# Altium schematic sheet RcMPPT-BMS.SchDoc: RcMPPT-BMS
size A4; Author: Thomas Hofmann; CompanyName: HTL St. Pölten; Organization: Altium Limited; Address1: RcMPPT; Address2: Frenchs Forest; Address3: NSW; Address4: Australia 2086; DocumentNumber: 2; Revision: 2.0; SheetNumber: 2; SheetTotal: 3
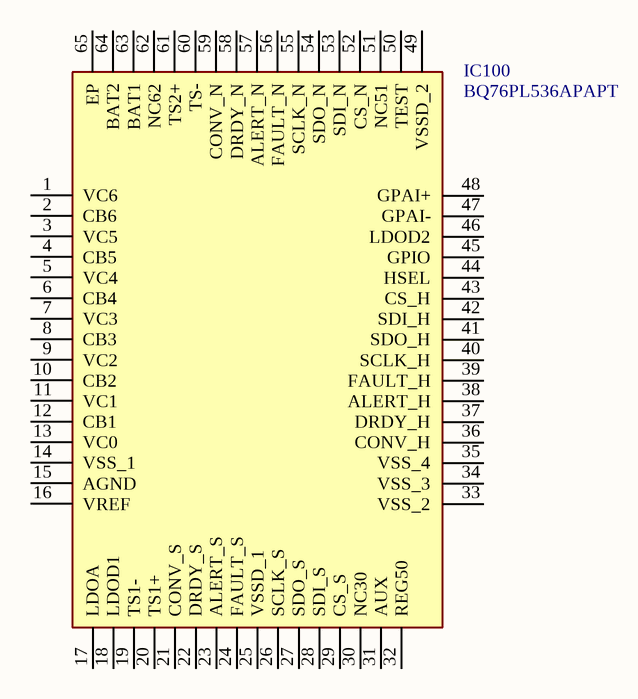
[diagram p0: RcMPPT-BMS.SchDoc]

## Parts
IC100  BQ76PL536APAPT  [QFP50P1200X1200X120-65N]

## Nets

Not connected (* = marked no-connect by the designer): IC100 1(VC6) 2(CB6) 3(VC5) 4(CB5) 5(VC4) 6(CB4) 7(VC3) 8(CB3) 9(VC2) 10(CB2) 11(VC1) 12(CB1) 13(VC0) 14(VSS_1) 15(AGND) 16(VREF) 17(LDOA) 18(LDOD1) 19(TS1-) 20(TS1+) 21(CONV_S) 22(DRDY_S) 23(ALERT_S) 24(FAULT_S) 25(VSSD_1) 26(SCLK_S) 27(SDO_S) 28(SDI_S) 29(CS_S) 30(NC30) 31(AUX) 32(REG50) 33(VSS_2) 34(VSS_3) 35(VSS_4) 36(CONV_H) 37(DRDY_H) 38(ALERT_H) 39(FAULT_H) 40(SCLK_H) 41(SDO_H) 42(SDI_H) 43(CS_H) 44(HSEL) 45(GPIO) 46(LDOD2) 47(GPAI-) 48(GPAI+) 49(VSSD_2) 50(TEST) 51(NC51) 52(CS_N) 53(SDI_N) 54(SDO_N) 55(SCLK_N) 56(FAULT_N) 57(ALERT_N) 58(DRDY_N) 59(CONV_N) 60(TS-) 61(TS2+) 62(NC62) 63(BAT1) 64(BAT2) 65(EP)

## Notes on the sheet
- Title
- Size:
- Date:
- A4
- Number:
- Time:
- Revision:
- Sheet
- of
- File:

## Library data of the parts
IC100 = BQ76PL536APAPT: Integrated Circuit; Manufacturer_Name: Texas Instruments; Datasheet Link: http://www.ti.com/lit/gpn/bq76pl536a; Height: 1.2mm; Manufacturer_Part_Number: BQ76PL536APAPT; Mouser Part Number: 595-BQ76PL536APAPT; Mouser Price/Stock: https://www.mouser.co.uk/ProductDetail/Texas-Instruments/BQ76PL536APAPT?qs=UlfnwZ2x8nT1EXA%252BD%252BEfIQ%3D%3D; Arrow Part Number: BQ76PL536APAPT; Arrow Price/Stock: https://www.arrow.com/en/products/bq76pl536apapt/texas-instruments?region=nac